# EAGLE design FT230X_LTC4053_BB_MINI_USB_B_V1a (EAGLE 5.07)
LICENSE: CC-0
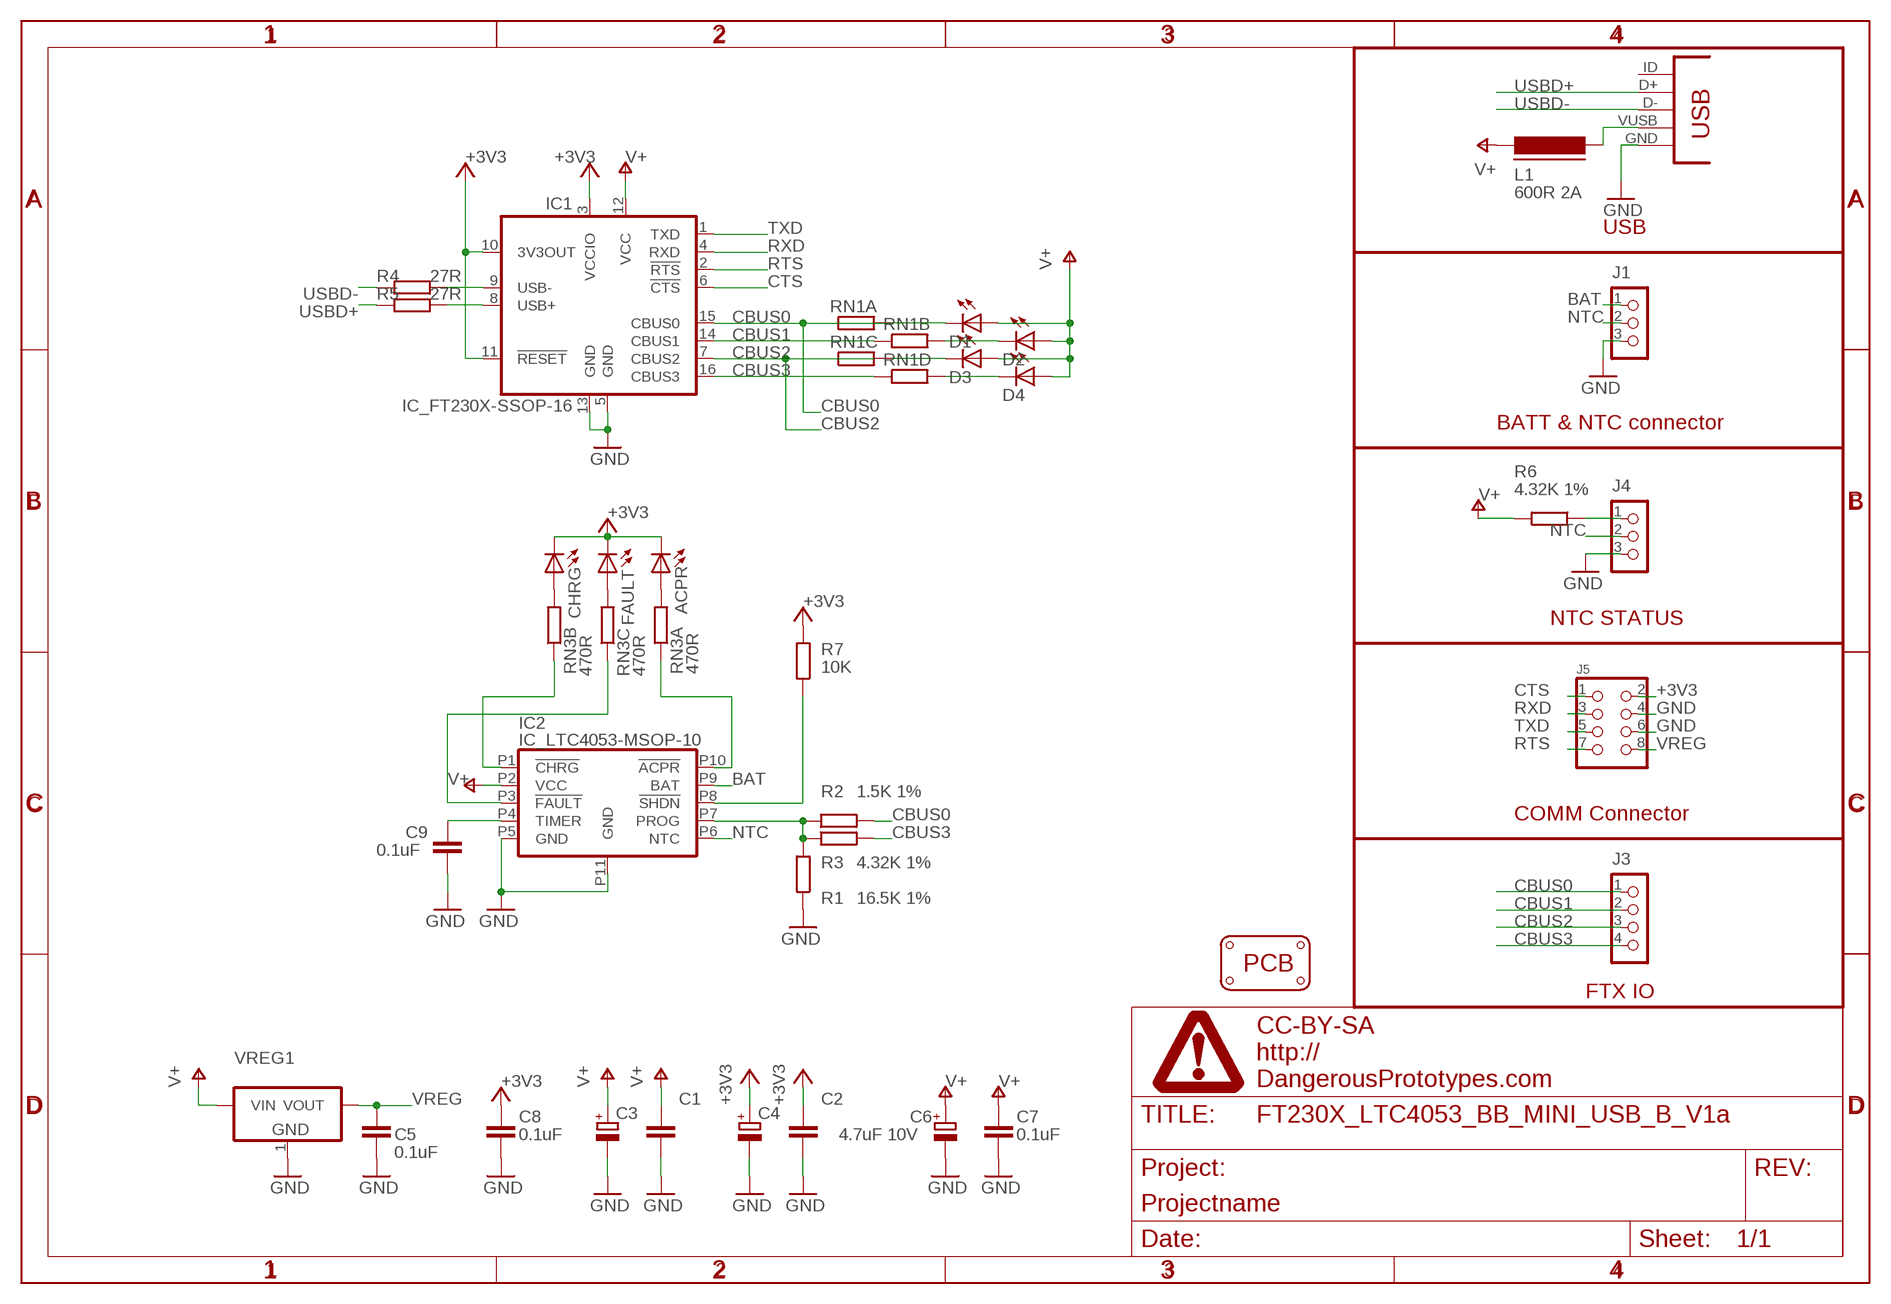
[diagram p0: schematic, sheet 1]

## Parts
ACPR  LED-0805  [LED-805]
C1  CAPACITOR_NPOL-0603  [C603]
C2  CAPACITOR_NPOL-0603  [C603]
C3  CAPACITOR_POL-SMC_A  [SMC_A]
C4  CAPACITOR_POL-SMC_A  [SMC_A]
C5  0.1uF  CAPACITOR_NPOL-0603  [C603]
C6  4.7uF 10V  CAPACITOR_POL-SMC_A  [SMC_A]
C7  0.1uF  CAPACITOR_NPOL-0603  [C603]
C8  0.1uF  CAPACITOR_NPOL-0603  [C603]
C9  0.1uF  CAPACITOR_NPOL-0603  [C603]
CHRG  LED-0805  [LED-805]
D1  LED-0805  [LED-805]
D2  LED-0805  [LED-805]
D3  LED-0805  [LED-805]
D4  LED-0805  [LED-805]
FAULT  LED-0805  [LED-805]
IC1  IC_FT230X-SSOP-16  [SSOP-16-FTDI]
IC2  IC_LTC4053-MSOP-10  [MSOP-10]
J1  CON_HEADER_1X03-PTH  [M1X3]
J3  CON_HEADER_1X04  [M1X4]
J4  CON_HEADER_1X03-PTH  [M1X3]
J5  CON_HEADER_2X04-PTH  [M2X4]
L1  600R 2A  FERRITE-0603  [FB603]
PCB1  PCB_DP_RECTANGLE-31X50  [DP5031_V1]
R1  16.5K 1%  RESISTOR-0603  [R603]
R2  1.5K 1%  RESISTOR-0603  [R603]
R3  4.32K 1%  RESISTOR-0603  [R603]
R4  27R  RESISTOR-0603  [R603]
R5  27R  RESISTOR-0603  [R603]
R6  4.32K 1%  RESISTOR-0603  [R603]
R7  10K  RESISTOR-0603  [R603]
RN1  RESISTOR_ARRAY_4  [RN8P-4R-CRA06S]
RN3  470R  RESISTOR_ARRAY_4  [RN8P-4R-CRA06S]
U$1  FRAME_DINA4_L  [DP_LOGO]
USB1  CON-USB-F-MINI-B  [CONN_USB_MINI-B]
VREG1  IC_VREG_3PINS-DPAK  [DPAK]

## Nets
+3V3: ACPR.C C2.1 C4.+ C8.1 CHRG.C FAULT.C IC1.3(VCCIO) IC1.10(3V3OUT) IC1.11(!RESET) J5.2 R7.2
BAT: IC2.P9(BAT) J1.1
CBUS0: IC1.15(CBUS0) J3.1 R2.2 RN1.1
CBUS1: IC1.14(CBUS1) J3.2 RN1.2
CBUS2: IC1.7(CBUS2) J3.3 RN1.3
CBUS3: IC1.16(CBUS3) J3.4 R3.2 RN1.4
CTS: IC1.6(!CTS) J5.1
GND: C1.2 C2.2 C3.- C4.- C5.2 C6.- C7.2 C8.2 C9.2 IC1.5(GND) IC1.13(GND) IC2.P5(GND) IC2.P11(GND) J1.3 J4.3 J5.4 J5.6 R1.1 USB1.GND VREG1.1(GND)
N$1: IC2.P10(!ACPR) RN3.1
N$2: IC2.P7(PROG) R1.2 R2.1 R3.1
N$3: IC2.P1(!CHRG) RN3.2
N$4: IC2.P3(!FAULT) RN3.3
N$5: D1.C RN1.8
N$6: D2.C RN1.7
N$7: D3.C RN1.6
N$8: D4.C RN1.5
N$9: IC2.P8(!SHDN) R7.1
N$10: J4.1 R6.1
N$11: IC1.9(USB-) R4.2
N$12: IC1.8(USB+) R5.2
N$13: C9.1 IC2.P4(TIMER)
N$14: FAULT.A RN3.6
N$15: CHRG.A RN3.7
N$16: ACPR.A RN3.8
NTC: IC2.P6(NTC) J1.2 J4.2
RTS: IC1.2(!RTS) J5.7
RXD: IC1.4(RXD) J5.3
TXD: IC1.1(TXD) J5.5
USBD+: R5.1 USB1.D+
USBD-: R4.1 USB1.D-
V+: C1.1 C3.+ C6.+ C7.1 D1.A D2.A D3.A D4.A IC1.12(VCC) IC2.P2(VCC) L1.1 R6.2 VREG1.3(VIN)
VREG: C5.1 J5.8 VREG1.2(VOUT)
VUSBE: L1.2 USB1.VUSB
Unconnected: RN3.4 RN3.5 USB1.BODY@1(BODY) USB1.BODY@2(BODY) USB1.BODY@3(BODY) USB1.BODY@4(BODY) USB1.ID(USBID)

## Notes on the sheet
- USB
- BATT & NTC connector
- NTC STATUS
- COMM Connector
- FTX IO

## Library data of the parts
ACPR CHRG D1-D4 FAULT = dp_devices:LED: Light Emitting Diode
C1 C2 C5 C7-C9 = dp_devices:CAPACITOR_NPOL: Non-Polarized capacitor in various packages
C3 C4 C6 = dp_devices:CAPACITOR_POL: Polarized capacitor in various packages
IC1 = dp_devices:IC_FT230X: BASIC USB to UART IC
IC2 = dp_devices:IC_LTC4053: USB Compatible Li-Ion Battery Charger
J1 J4 = dp_devices:CON_HEADER_1X03
J3 = dp_devices:CON_HEADER_1X04
J5 = dp_devices:CON_HEADER_2X04
L1 = dp_devices:FERRITE: Ferrite bead in various packages
PCB1 = dp_devices:PCB_DP_RECTANGLE: Dangerous Prototypes Standard Rectangular PCB sizes
R1-R7 = dp_devices:RESISTOR
RN1 RN3 = dp_devices:RESISTOR_ARRAY_4: 4 Resistor Array 0603
U$1 = dp_devices:FRAME_DINA4_L: A4 DP frame Standard Dangerous Prototypes schematic frame. Automagically adds the DP logo and standard texts to the PCB Use the atrribute in the schematic editor to change the fields.; FF1: fulfillment by; FF2: Seeed Studio; FF3: www.seeedstudio.com; LICENSE: CC-BY-SA; PROJECT: Projectname; URL1: http://; URL2: DangerousPrototypes.com
USB1 = dp_devices:CON-USB-F: USB Female connector
VREG1 = dp_devices:IC_VREG_3PINS: Various 3 pin voltage regulators in different packages Double check the right pinout for the right part

## Board
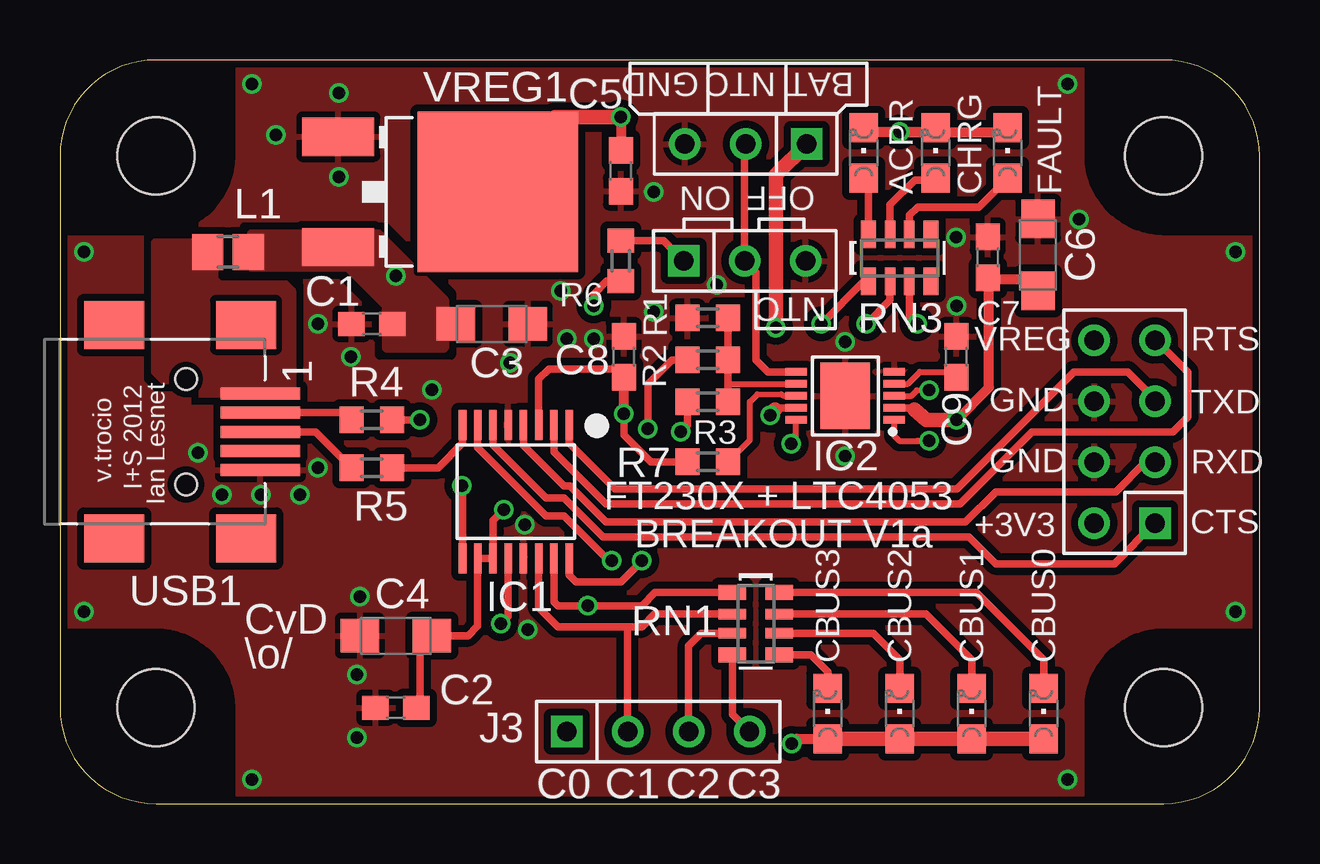
[diagram p1: board, top side]
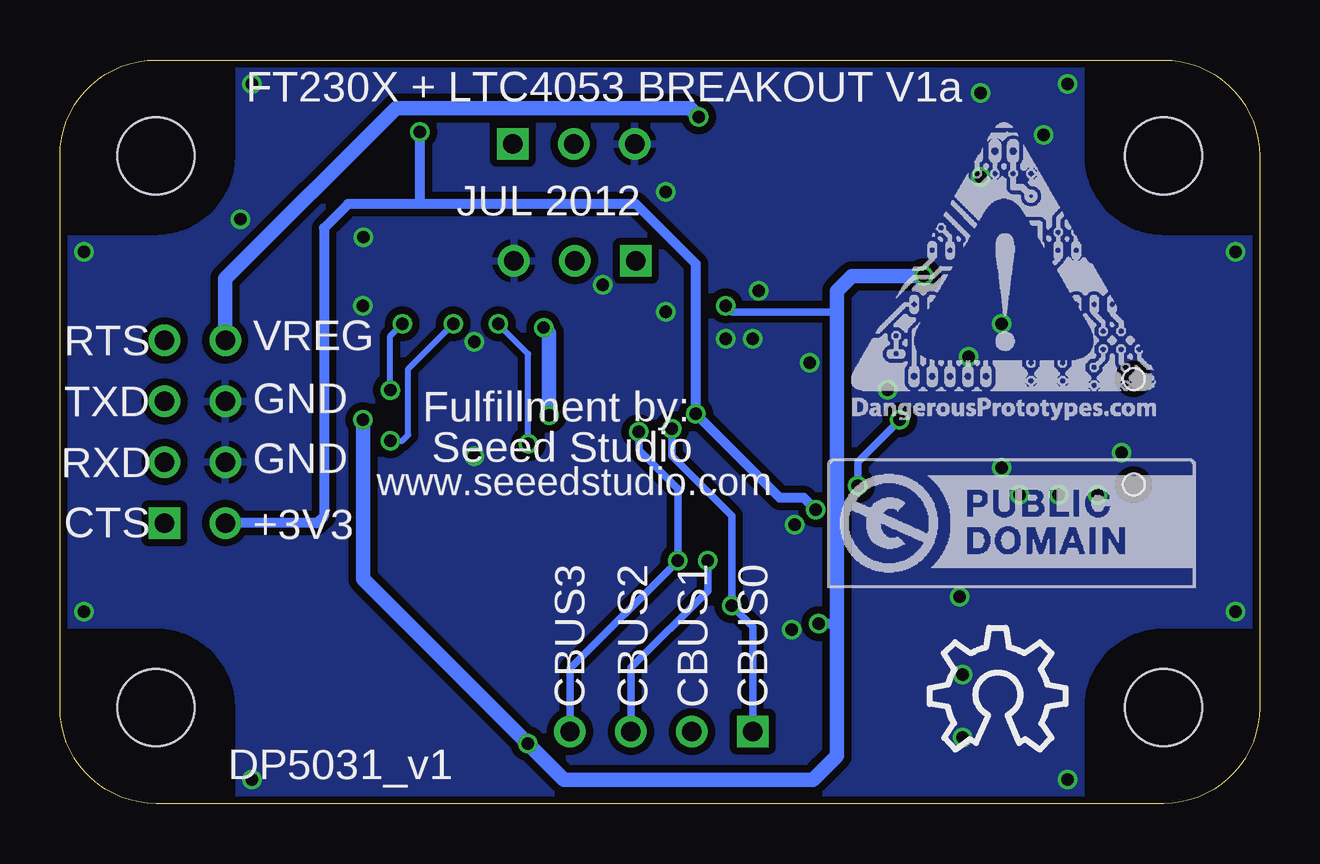
[diagram p2: board, bottom side, seen from below]

Size 50 x 31 mm. Coordinates in mm from the lower left corner, seen from the top.
Copper layers (1*16): Top 0.035mm / dielectric 1.5mm / Bottom 0.035mm
Design rules "Fusion_eagle_rule_v1.1": minimum track width 6mil, minimum drill 12mil, track to track 6mil, track to pad 6mil, pad to pad 6mil, via to via 6mil, smd to smd 0mil, copper to edge 10mil, drill to drill 10mil, minimum pad ring 10mil, minimum via ring 6mil, stop-mask expansion 2mil, vias tented up to drill 100mil, thermal gap 10mil

### Footprints (pad centres in the part's own frame; a part is rotated, then mirrored left to right if it is on the bottom)
LED-805 = smd 1.2 x 1.2: A 0,-1.05; C 0,1.05
C603 = smd 1.1 x 1: 1 -0.85,0; 2 0.85,0
SMC_A = smd 1.6 x 1.4: + -1.5,0; - 1.5,0
SSOP-16-FTDI = smd 0.32 x 1.26: 1 -2.223,-2.779; 2 -1.588,-2.779; 3 -0.953,-2.779; 4 -0.318,-2.779; 5 0.317,-2.779; 6 0.952,-2.779; 7 1.587,-2.779; 8 2.222,-2.779; 9 2.222,2.779; 10 1.587,2.779; 11 0.952,2.779; 12 0.317,2.779; 13 -0.318,2.779; 14 -0.953,2.779; 15 -1.588,2.779; 16 -2.223,2.779
MSOP-10 = smd 0.31 x 0.89: P1 -1,-2.045; P2 -0.5,-2.045; P3 0,-2.045; P4 0.5,-2.045; P5 1,-2.045; P6 1,2.045; P7 0.5,2.045; P8 0,2.045; P9 -0.5,2.045; P10 -1,2.045 | smd 2.79 x 2.08: P11 0,0
M1X3 = drill 0.8 square: 1 0,0 | drill 0.8 round: 2 2.54,0; 3 5.08,0
M1X4 = drill 0.8 square: 1 0,0 | drill 0.8 round: 2 2.54,0; 3 5.08,0; 4 7.62,0
M2X4 = drill 0.8 square: 1 -3.81,-1.27 | drill 0.8 round: 2 -3.81,1.27; 3 -1.27,-1.27; 4 -1.27,1.27; 5 1.27,-1.27; 6 1.27,1.27; 7 3.81,-1.27; 8 3.81,1.27
FB603 = smd 1.3 x 1.5: 1 -0.85,0; 2 0.85,0
DP5031_V1 = hole 3.2: 4,4; 46,4; 46,27; 4,27
R603 = smd 1 x 1.1: 1 -0.85,0; 2 0.85,0
RN8P-4R-CRA06S = smd 0.63 x 1.15: 1 -1.295,-0.975; 4 1.295,-0.975; 5 1.295,0.975; 8 -1.295,0.975 | smd 0.44 x 1.15: 2 -0.4,-0.975; 3 0.4,-0.975; 6 0.4,0.975; 7 -0.4,0.975
CONN_USB_MINI-B = smd 2 x 2.5: BODY@1 -4.45,2.5; BODY@2 4.45,2.5; BODY@3 4.45,-3; BODY@4 -4.45,-3 | smd 0.5 x 3.3: D+ 0,3.1; D- -0.8,3.1; GND 1.6,3.1; ID 0.8,3.1; VUSB -1.6,3.1 | hole 0.9: -2.2,0; 2.2,0
DPAK = smd 1.6 x 3: 1 -2.3,-6.65; 3 2.3,-6.65 | smd 6.7 x 6.7: 2 0,0

### Placement (x,y rotation side)
ACPR  33.5,27.12 0 top
C1  13,20 180 top
C2  14,4 180 top
C3  18,20 0 top
C4  14,7 180 top
C5  23.38,26.38 270 top
C6  40.77,22.88 90 top
C7  38.67,22.77 90 top
C8  23.5,18.62 90 top
C9  37.35,18.62 90 top
CHRG  36.5,27.12 0 top
D1  41,3.75 0 top
D2  38,3.75 0 top
D3  35,3.75 0 top
D4  32,3.75 0 top
FAULT  39.5,27.12 0 top
IC1  19,13 180 top
IC2  32.73,17 90 top
J1  31.12,27.5 180 top
J3  21.12,3 0 top
J4  26,22.62 0 top
J5  44.38,15.5 90 top
L1  7,23 180 top
PCB1  0,0 0 top
R1  27,20.25 0 top
R2  27,18.5 180 top
R3  27,16.75 180 top
R4  13,16 0 top
R5  13,14 0 top
R6  23.38,22.62 270 top
R7  27,14.25 180 top
RN1  29,7.5 270 top
RN3  35,22.75 0 top
U$1  57.3,21.52 0 top  (outside the outline)
U$3  [DP_LOGO_ART_0.5X0.5]  17,16 0 bottom
U$4  [LOGO_CC-0]  18,9 0 bottom
U$5  [OSHW_10X200_NOTEXT]  13.75,2.25 0 bottom
USB1  5.25,15.5 270 top
VREG1  18.25,25.5 270 top

### Tracks (layer width: path | path; a pad name or v marks a point on that pad's centre or on a via)
+3V3  (via drill 0.51)
  Top 0.305: C2.1 15,4.15 15,7 C4.+ 17,7 17.41,7.41 IC1.10 IC1.11 18.05,11.8 v18.5,12.25 | C8.1 23.4,18.12 20.38,18.12 19.95,17.7 IC1.3 | v23.5,16.25 23.5,15.38 24.62,14.25 R7.2
  Top 0.406: v23.5,16.25 C8.1 | ACPR.C 33.5,28 36.33,28 CHRG.C 36.5,28 v35,28 39.33,28 FAULT.C
  Bottom 0.406: J5.2 39.31,11.69 39,12 39,24 38,25 35,25 | 35,25 26,25 23.5,22.5 v23.5,16.25 20,12.75 19,12.75 v18.5,12.25 | 35,25 v35,28
BAT  (via drill 0.51)
  Top 0.305: 29.79,16.44 29.88,16.5 IC2.P9
  Top 0.61: v29.61,16.19 29.79,16.44 | v29.84,19.84 29.84,26.22 J1.1
  Bottom 0.61: v29.61,16.19 29.61,19.61 v29.84,19.84
CBUS0  (via drill 0.51)
  Top 0.305: RN1.1 24.8,8.79 24.25,8.25 v22,8.25 20.75,8.25 20.59,8.41 IC1.15 | R2.2 25.5,18.5 24.5,17.5 v24.5,15.62
  Bottom 0.305: J3.1 21.12,7.38 v22,8.25 22,12 24.5,14.5 v24.5,15.62
CBUS1
  Top 0.305: RN1.2 24.77,7.9 24.25,7.38 23.66,7.38 | 23.66,7.38 20.75,7.38 20.06,8.06 19.99,8.13 19.95,8.17 IC1.14 | J3.2 23.66,7.38
CBUS2  (via drill 0.51)
  Top 0.305: RN1.3 26.73,7.1 26.2,6.58 J3.3 | IC1.7 17.41,14.84 20.25,12 21,12 22.88,10.12 v23,10.12
  Bottom 0.305: J3.3 26.2,5.67 23,8.88 v23,10.12
CBUS3  (via drill 0.51)
  Top 0.305: RN1.4 28.02,3.72 J3.4 | v24.25,10.12 23.38,9.25 21.5,9.25 21.22,9.53 IC1.16 | R3.2 26.15,15.78 v25.88,15.5
  Bottom 0.305: J3.4 28.75,5.63 v24.25,10.12 24.25,13.12 25.88,14.75 v25.88,15.5
CTS
  Top 0.305: J5.1 43.95,10 39,10 37.88,11.12 22.62,11.12 21,12.75 20.25,12.75 18.05,14.95 IC1.6
GND  (via drill 0.51)
  other vias: 32.73,19.25 32.73,14.49 42.48,24.36 37.35,23.61 49,23 42,30 8,30 1,23 1,8 8,1 42,1 49,8 19.5,7.25 19.38,11.62 15.5,17.25 10.75,14 5.75,14.62 8.38,12.88 10,12.88 6.75,12.88 11.62,29.62 9,27.88 11.62,26.12 24.75,25.5 22.25,19.38 21.12,19.38 10.75,20 12.12,18.62 18.75,18.38 27.38,21.62 37.38,20.75 12.5,8.62 12.38,5.38 12.38,2.75 24.75,20.5 20.88,21.38
  pour Bottom (isolate 0.305): 0,31 0,0 50,0 50,31
  pour Top (isolate 0.305, rank 6): 0,31 0,0 50,0 50,31
N$1  (via drill 0.51)
  Top 0.254: IC2.P10 30.69,15.21 v30.48,15
  Top 0.305: RN3.1 33.51,21.77 v31.73,20
  Bottom 0.254: v30.48,15 30.48,18.75 v31.73,20
N$2
  Top 0.254: 27.85,17.5 IC2.P7
  Top 0.305: R1.2 R2.1 27.85,17.5 R3.1
N$3  (via drill 0.51)
  Top 0.254: 35.73,15.12 v36.23,15.12 34.98,15.12 34.77,15.33 IC2.P1
  Top 0.305: RN3.2 34.6,21 v33.6,20
  Bottom 0.254: v36.23,15.12 35.73,15.12 35.48,15.38 35.48,18.12 v33.6,20
N$4  (via drill 0.51)
  Top 0.254: IC2.P3 35.49,17 35.72,17.22 v36.23,17.24
  Top 0.305: RN3.3 35.4,20.33 v35.73,20
  Bottom 0.254: v36.23,17.24 36.23,19.5 v35.73,20
N$5
  Top 0.305: RN1.8 38.2,8.79 41,6 D1.C
N$6
  Top 0.305: RN1.7 36.1,7.9 38,6 D2.C
N$7
  Top 0.305: RN1.6 33.9,7.1 35,6 D3.C
N$8
  Top 0.305: RN1.5 31.3,6.21 32,5.5 D4.C
N$9
  Top 0.254: IC2.P8 30.18,17 30.05,17.07 29.06,17.06 28.75,16.75 28.75,15.15 R7.1
N$10
  Top 0.305: R6.1 25.15,23.48 J4.1
N$11  (via drill 0.51)
  Top 0.305: IC1.9 16.78,13.22 v16.75,13.25 | v15,16 R4.2
  Bottom 0.305: v16.75,13.25 16.75,14.25 v15,16
N$12
  Top 0.305: R5.2 15.75,14 16.78,15.03 IC1.8
N$13
  Top 0.254: IC2.P4 35.34,17.5 35.84,18 37.26,18 C9.1
N$14
  Top 0.305: RN3.6 35.4,24.52 35.75,24.88 38.3,24.88 FAULT.A
N$15
  Top 0.305: RN3.7 34.6,24.98 35.62,26 36.42,26 CHRG.A
N$16
  Top 0.305: RN3.8 33.7,25.87 ACPR.A
NTC
  Top 0.305: J1.2 28.54,27.45 J4.2 29,22.16 29,18.5 29.5,18 IC2.P6
RTS
  Top 0.305: J5.7 45.69,19.31 47,18 47,16.12 46.38,15.5 40.5,15.5 37.5,12.5 22.75,12.5 20.59,14.66 IC1.2
RXD
  Top 0.305: J5.3 45.23,14.23 44,13 39,13 37.75,11.75 22.75,11.75 21.25,13.25 21,13.25 19.32,14.93 IC1.4
TXD
  Top 0.305: J5.5 45.65,16.86 44.5,18 42.25,18 37.38,13.12 23.12,13.12 21.22,15.03 IC1.1
USBD+
  Top 0.305: R5.1 10.65,15.5 USB1.D+
USBD-
  Top 0.305: 11.85,16.3 R4.1 12.15,16.3 USB1.D-
V+  (via drill 0.51)
  Top 0.305: 35.6,16.42 35.56,16.51 35.55,16.5 IC2.P2 | R6.2 22.77,21.77 22.25,21.25 v22.25,20.75 | IC1.12 18.68,7.81 v18.38,7.5
  Top 0.406: D4.A 30.7,2.7 v30.5,2.5 | C6.+ 40.77,21.86 40.75,21.88 38.72,21.88 | 38.72,21.88 C7.1 | 38.72,21.88 38.72,17.34 v37.38,16
  Top 0.61: D1.A D2.A D3.A D4.A | 35.6,16.42 36.1,16 v37.38,16
  Bottom 0.305: v22.25,20.75 22,20.5 17.62,20.5 17.62,21
  Bottom 0.406: 17.62,7.5 v18.38,7.5
  Bottom 0.61: v37.38,16 37.38,9.38 v30.5,2.5 29,1 18.62,1 17.62,2 17.62,7.5 17.62,21 17.62,21.38 17,22 v14,22
  pour Top (no thermals): 8,22.38 8,23.75 13.25,23.75 16,21 16,19 13.62,19 13.62,20.75 12,22.38
VREG  (via drill 0.51)
  Top 0.406: 20.62,28.62 20,28 20,27.25 VREG1.2 | v23.38,28.62 C5.1
  Top 0.61: 20.62,28.62 v23.38,28.62
  Bottom 0.61: J5.8 43.1,21.89 36,29 23.75,29 v23.38,28.62
VUSBE
  pour Top (isolate 0.254, no thermals): 9.62,17.12 4.88,17.12 4,18 4,23.38 6.25,23.38 6.38,23.25 6.38,21.88 6.62,21.62 9.38,21.62 9.62,21.38

### Text on the board
tPlace: GND | NTC | BAT | ON | OFF | NTC | VREG | RTS | GND | TXD | GND | RXD | v.trocio | I+S 2012 | Ian Lesnet | FT230X + LTC4053 | BREAKOUT V1a | +3V3 | CTS | CvD | \\o/ | CBUS3 | CBUS2 | CBUS1 | CBUS0 | C0 | C1 | C2 | C3
bPlace: FT230X + LTC4053 BREAKOUT V1a | JUL 2012 | VREG | RTS | Fulfillment by: | GND | TXD | Seeed Studio | GND | RXD | www.seeedstudio.com | +3V3 | CTS | CBUS0 | CBUS1 | CBUS2 | CBUS3